# EAGLE design SparkFun_Touch_Screen_Connector_Breakout_DS (EAGLE 7.5.0)
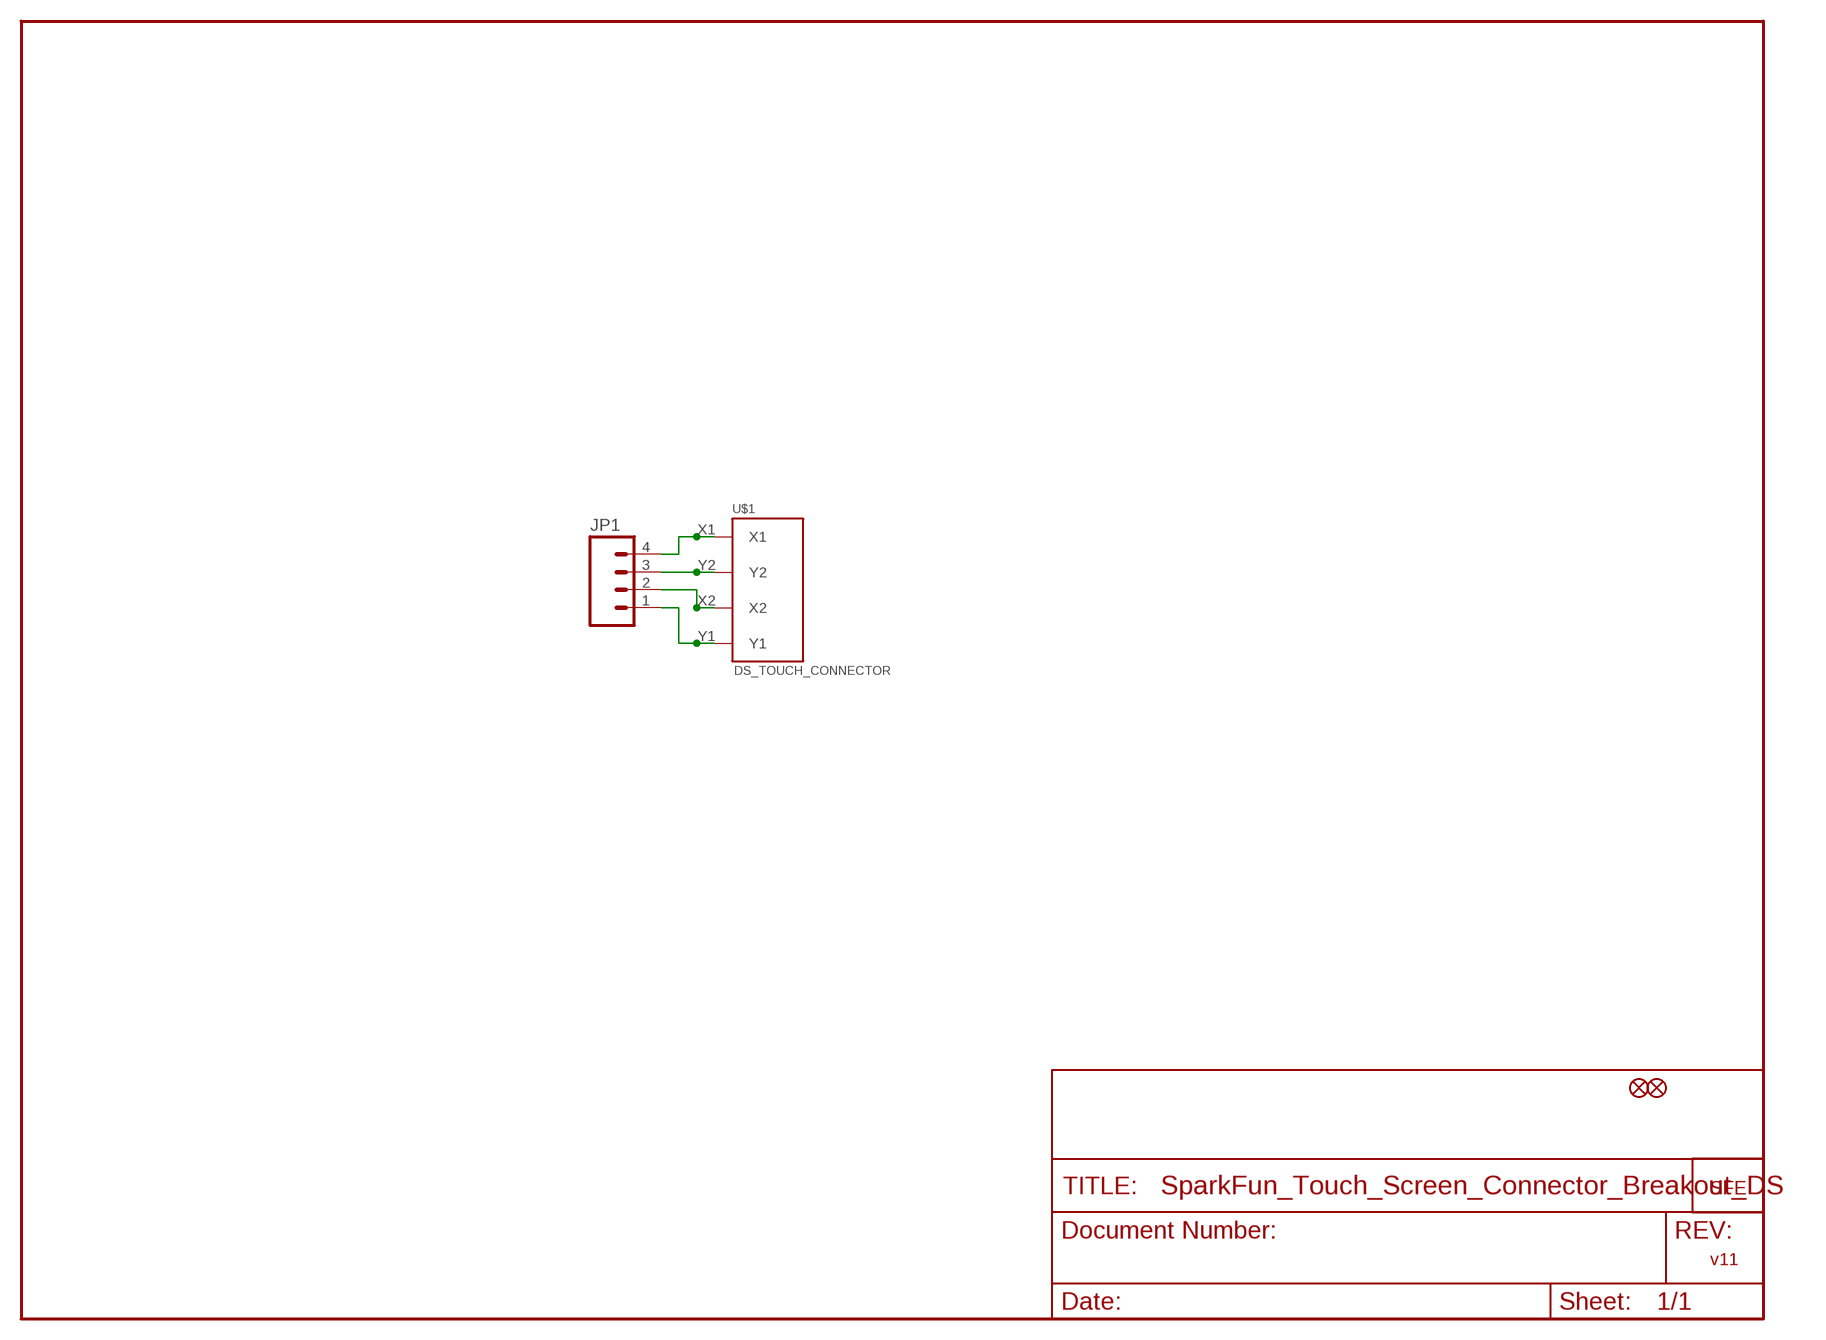
[diagram p0: schematic, sheet 1]

## Parts
FID1  FIDUCIAL1X2  [FIDUCIAL-1X2]
FID2  FIDUCIAL1X2  [FIDUCIAL-1X2]
JP1  M04PTH  [1X04]
U$1  DS_TOUCH_CONNECTOR  [DS_TOUCH_CONNECTOR]
U$2  LOGO-SFESK  [SFE-LOGO-FLAME]

## Nets
N$1: JP1.4 U$1.X1
N$2: JP1.3 U$1.Y2
N$3: JP1.2 U$1.X2
N$4: JP1.1 U$1.Y1

## Notes on the sheet
- v11

## Library data of the parts
FID1 FID2 = SparkFun-Aesthetics:FIDUCIAL: Fiducial Alignment Points Various fiducial points for machine vision alignment.
JP1 = SparkFun:M04: Header 4 Standard 4-pin 0.1" header. Use with straight break away headers (SKU : PRT-00116), right angle break away headers (PRT-00553), swiss pins (PRT-00743), machine pins (PRT-00117), and female headers (PRT-00115). Molex polarized connector foot print use with SKU : PRT-08231 with associated crimp pins and housings.
U$1 = SparkFun:DS_TOUCH_CONNECTOR: 4-pin DS touch screen connector
U$2 = SparkFun:LOGO-SFE: Spark Fun Electronics PCB Logo This is the standard Spark Fun Electronics PCB logo.

## Board
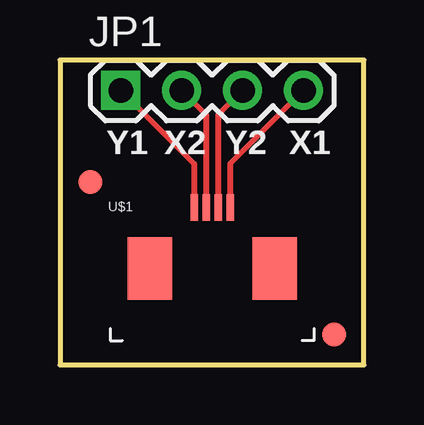
[diagram p1: board, top side]
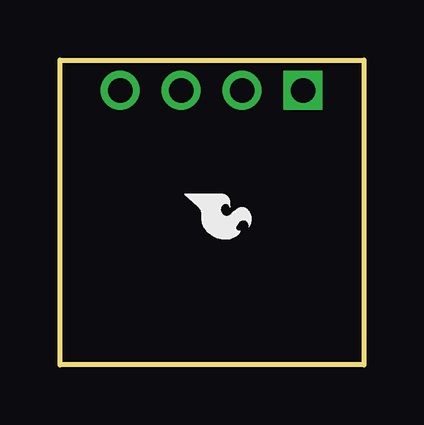
[diagram p2: board, bottom side, seen from below]

Size 12.68 x 12.7 mm. Coordinates in mm from the lower left corner, seen from the top.
Outline: 0,0 12.68,0 12.68,12.7 0,12.7 0,0
Copper layers (1*16): Top 0.035mm / dielectric 1.5mm / Bottom 0.035mm
Design rules "SparkFun": minimum track width 8mil, minimum drill 20mil, track to track 8mil, track to pad 8mil, pad to pad 8mil, via to via 8mil, smd to smd 8mil, copper to edge 10mil, drill to drill 8mil, minimum pad ring 12mil, minimum via ring 10mil, stop-mask expansion 4mil, vias tented up to drill 25mil, thermal gap 10mil

### Footprints (pad centres in the part's own frame; a part is rotated, then mirrored left to right if it is on the bottom)
FIDUCIAL-1X2 = smd 1 x 1: 1 0,0
1X04 = drill 1.016 square: 1 0,0 | drill 1.016: 2 2.54,0; 3 5.08,0; 4 7.62,0
DS_TOUCH_CONNECTOR = smd 1.85 x 2.6: P$5 -2.6,0.2; P$6 2.6,0.2 | smd 0.3 x 1.1: X1 0.75,2.75; X2 -0.25,2.75; Y1 -0.75,2.75; Y2 0.25,2.75

### Placement (x,y rotation side)
FID1  1.27,7.62 0 top
FID2  11.43,1.27 0 top
JP1  2.54,11.43 0 top
U$1  6.35,3.81 0 top
U$2  7.49,7.11 270 bottom

### Tracks (layer width: path | path; a pad name or v marks a point on that pad's centre or on a via)
N$1
  Top 0.203: 7.1,8.37 JP1.4
  Top 0.254: 7.1,8.37 U$1.X1
N$2
  Top 0.203: 6.6,10.41 JP1.3
  Top 0.254: 6.6,10.41 U$1.Y2
N$3
  Top 0.203: JP1.2 6.1,10.41
  Top 0.254: 6.1,10.41 U$1.X2
N$4
  Top 0.203: JP1.1 5.6,8.37
  Top 0.254: 5.6,8.37 U$1.Y1

### Text on the board
tPlace: Y1 | X2 | Y2 | X1